# Altium schematic sheet FSRs.SchDoc
size A3; SheetNumber: 5; SheetTotal: 6
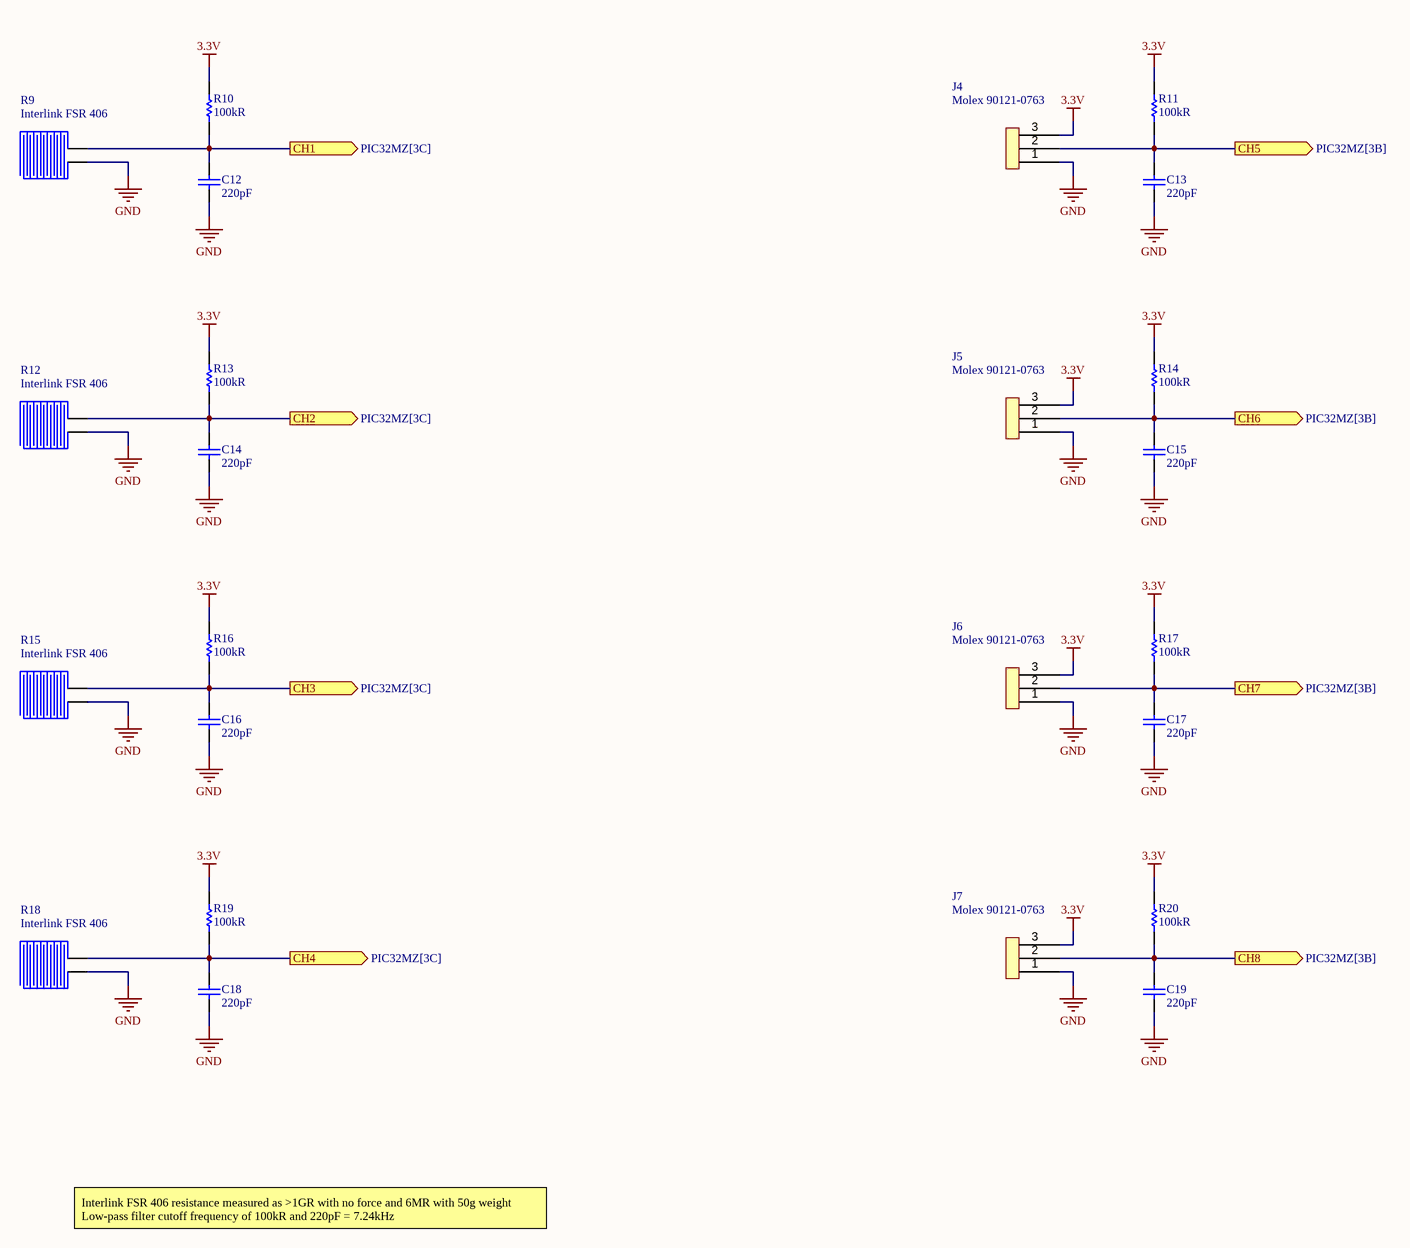
[diagram p0: FSRs.SchDoc]

## Parts
C12  220pF  [Capacitor 0402]
C13  220pF  [Capacitor 0402]
C14  220pF  [Capacitor 0402]
C15  220pF  [Capacitor 0402]
C16  220pF  [Capacitor 0402]
C17  220pF  [Capacitor 0402]
C18  220pF  [Capacitor 0402]
C19  220pF  [Capacitor 0402]
J4  Molex 90121-0763  [Molex 90121-0763]
J5  Molex 90121-0763  [Molex 90121-0763]
J6  Molex 90121-0763  [Molex 90121-0763]
J7  Molex 90121-0763  [Molex 90121-0763]
R9  Interlink FSR 406  [Interlink FSR 406]
R10  100kR  [Resistor 0402]
R11  100kR  [Resistor 0402]
R12  Interlink FSR 406  [Interlink FSR 406]
R13  100kR  [Resistor 0402]
R14  100kR  [Resistor 0402]
R15  Interlink FSR 406  [Interlink FSR 406]
R16  100kR  [Resistor 0402]
R17  100kR  [Resistor 0402]
R18  Interlink FSR 406  [Interlink FSR 406]
R19  100kR  [Resistor 0402]
R20  100kR  [Resistor 0402]

## Ports
CH1 (out, see PIC32MZ[3C]), CH2 (out, see PIC32MZ[3C]), CH3 (out, see PIC32MZ[3C]), CH4 (out, see PIC32MZ[3C]), CH5 (out, see PIC32MZ[3B]), CH6 (out, see PIC32MZ[3B]), CH7 (out, see PIC32MZ[3B]), CH8 (out, see PIC32MZ[3B])

## Nets
3.3V: J4.3 J5.3 J6.3 J7.3 R10.2 R11.2 R13.2 R14.2 R16.2 R17.2 R19.2 R20.2
GND: C12.1 C13.1 C14.1 C15.1 C16.1 C17.1 C18.1 C19.1 J4.1 J5.1 J6.1 J7.1 R9.2 R12.2 R15.2 R18.2
CH1: C12.2 R9.1 R10.1 ; port CH1
CH2: C14.2 R12.1 R13.1 ; port CH2
CH3: C16.2 R15.1 R16.1 ; port CH3
CH4: C18.2 R18.1 R19.1 ; port CH4
CH5: C13.2 J4.2 R11.1 ; port CH5
CH6: C15.2 J5.2 R14.1 ; port CH6
CH7: C17.2 J6.2 R17.1 ; port CH7
CH8: C19.2 J7.2 R20.1 ; port CH8

## Notes on the sheet
- Interlink FSR 406 resistance measured as >1GR with no force and 6MR with 50g weight
  Low-pass filter cutoff frequency of 100kR and 220pF = 7.24kHz
- TITLE
- SIZE
- A3
- VARIANT
- PROJECT
- SHEET
- VERSION
- OF
- AUTHOR
- DATE

## Library data of the parts
C12-C19 = Capacitor
R10 R11 R13 R14 R16 R17 R19 R20 = Resistor